# Altium schematic sheet 04_DISCRETE_MIXER_IQ.SchDoc
size A3; SheetNumber: 4; SheetTotal: 6
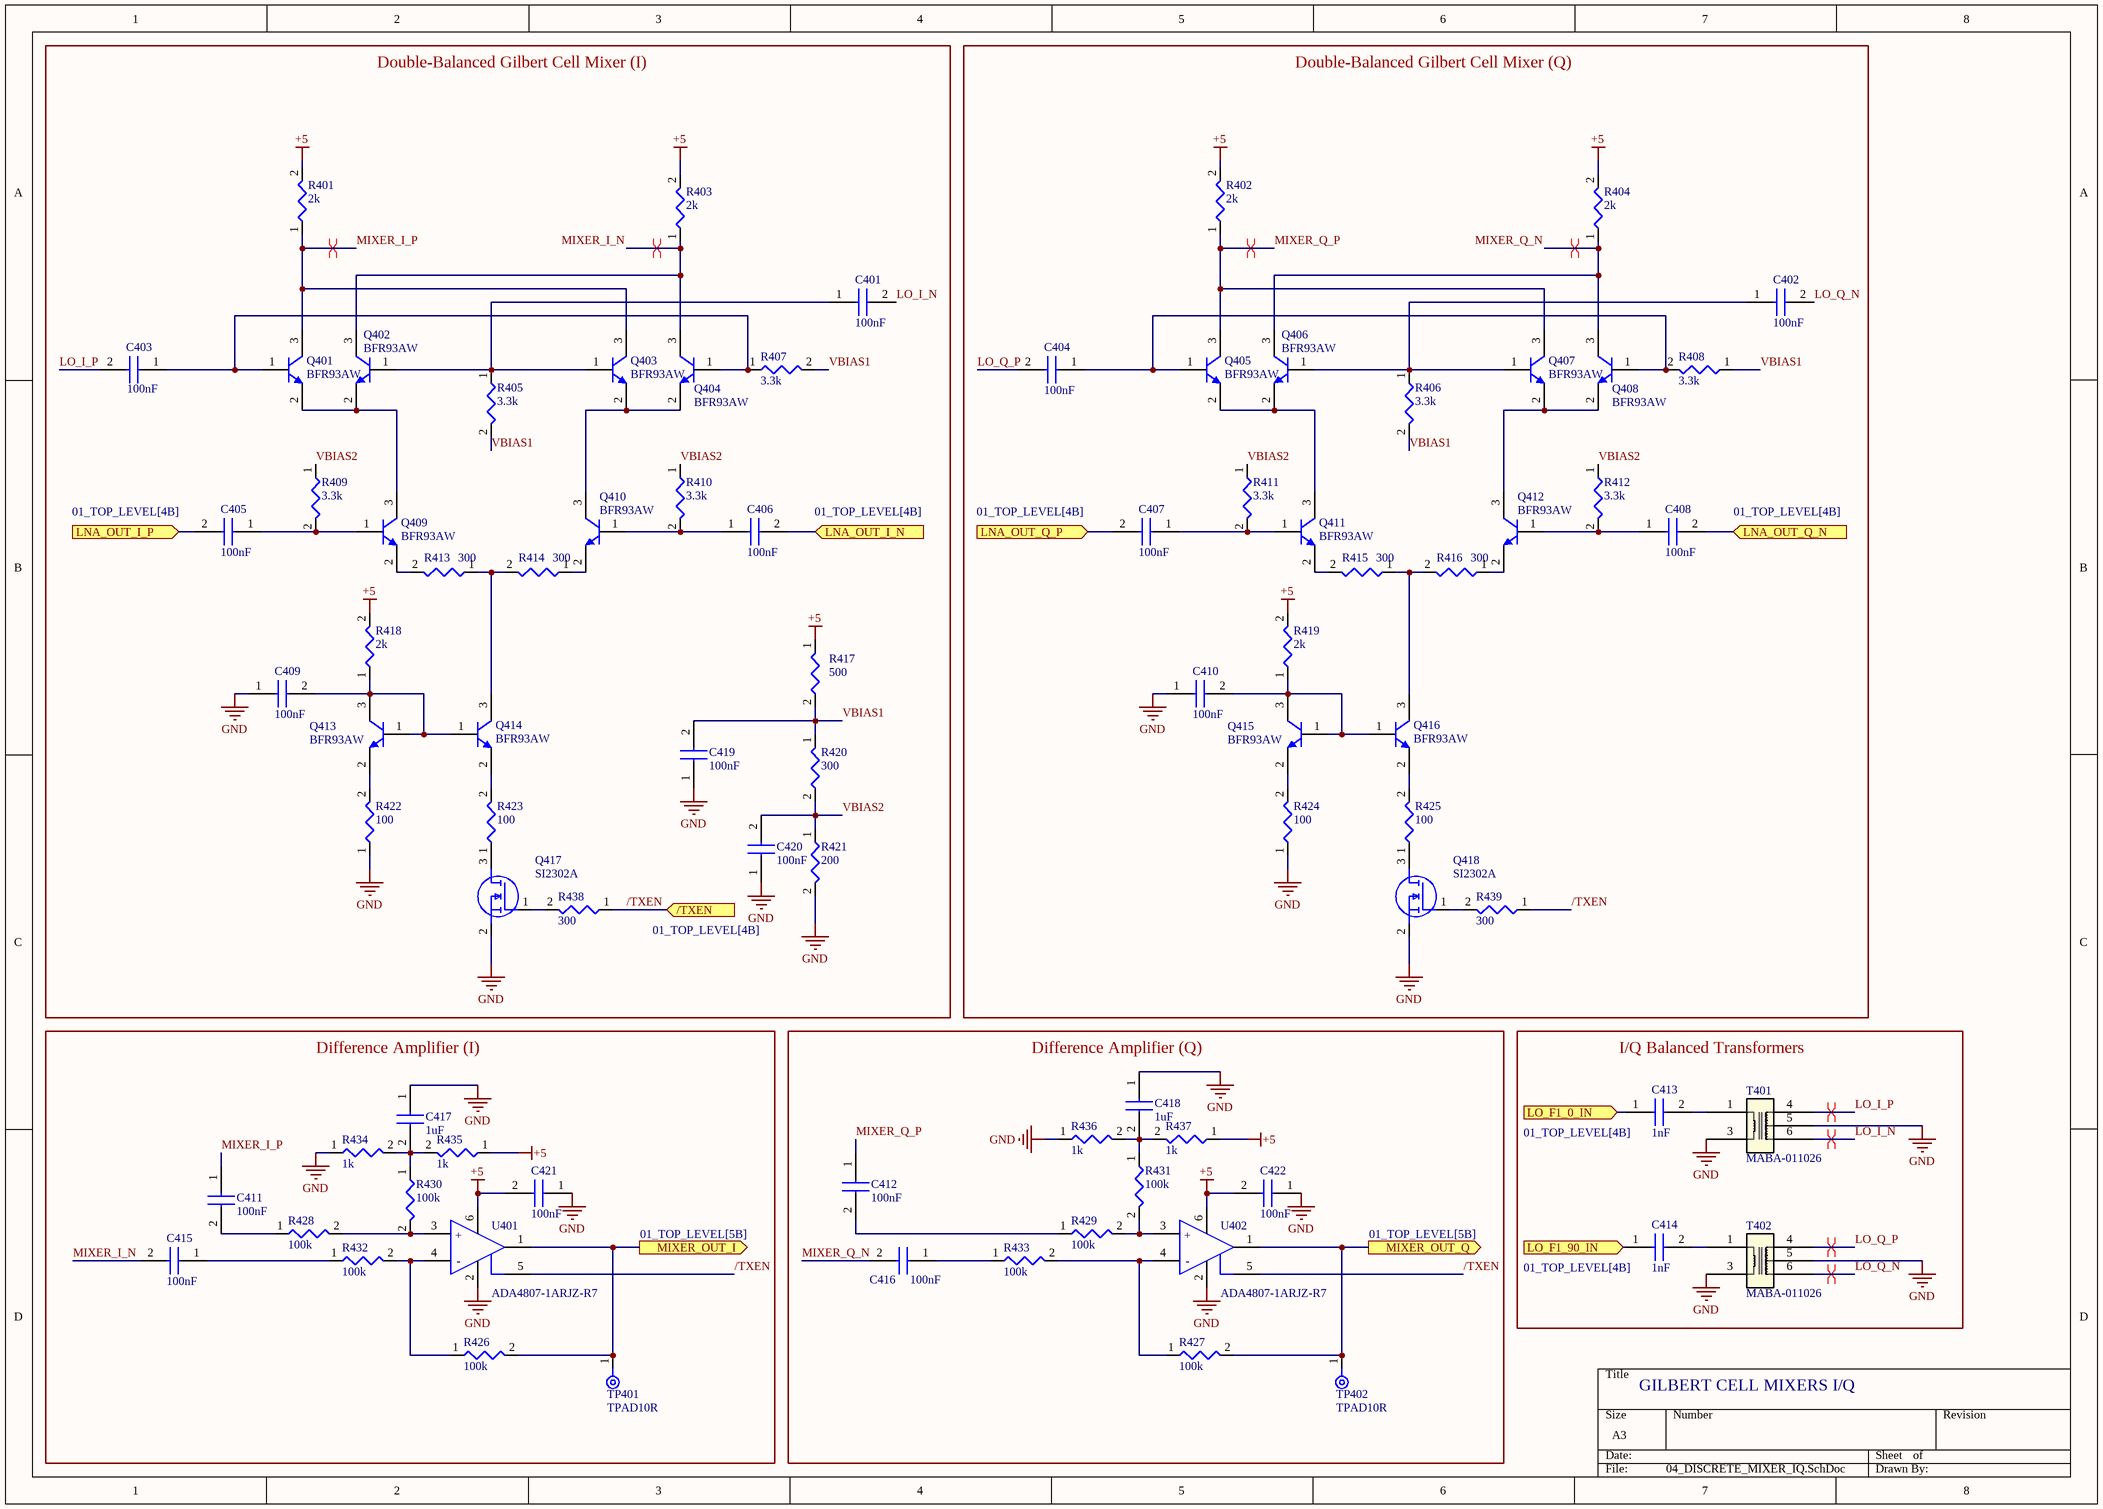
[diagram p0: 04_DISCRETE_MIXER_IQ.SchDoc]

## Parts
C401  100nF  [CAP_0805]
C402  100nF  [CAP_0805]
C403  100nF  [CAP_0805]
C404  100nF  [CAP_0805]
C405  100nF  [CAP_0805]
C406  100nF  [CAP_0805]
C407  100nF  [CAP_0805]
C408  100nF  [CAP_0805]
C409  100nF  [CAP_0805]
C410  100nF  [CAP_0805]
C411  100nF  [CAP_0805]
C412  100nF  [CAP_0805]
C413  1nF  [CAP_0805]
C414  1nF  [CAP_0805]
C415  100nF  [CAP_0805]
C416  100nF  [CAP_0805]
C417  1uF  [CAP_0805]
C418  1uF  [CAP_0805]
C419  100nF  [CAP_0805]
C420  100nF  [CAP_0805]
C421  100nF  [CAP_0805]
C422  100nF  [CAP_0805]
Q401  BFR93AW  [INF-SOT323_M]
Q402  BFR93AW  [INF-SOT323_M]
Q403  BFR93AW  [INF-SOT323_M]
Q404  BFR93AW  [INF-SOT323_M]
Q405  BFR93AW  [INF-SOT323_M]
Q406  BFR93AW  [INF-SOT323_M]
Q407  BFR93AW  [INF-SOT323_M]
Q408  BFR93AW  [INF-SOT323_M]
Q409  BFR93AW  [INF-SOT323_M]
Q410  BFR93AW  [INF-SOT323_M]
Q411  BFR93AW  [INF-SOT323_M]
Q412  BFR93AW  [INF-SOT323_M]
Q413  BFR93AW  [INF-SOT323_M]
Q414  BFR93AW  [INF-SOT323_M]
Q415  BFR93AW  [INF-SOT323_M]
Q416  BFR93AW  [INF-SOT323_M]
Q417  SI2302A  [SOT95P237X112-3N]
Q418  SI2302A  [SOT95P237X112-3N]
R401  2k  [RES_0805]
R402  2k  [RES_0805]
R403  2k  [RES_0805]
R404  2k  [RES_0805]
R405  3.3k  [RES_0805]
R406  3.3k  [RES_0805]
R407  3.3k  [RES_0805]
R408  3.3k  [RES_0805]
R409  3.3k  [RES_0805]
R410  3.3k  [RES_0805]
R411  3.3k  [RES_0805]
R412  3.3k  [RES_0805]
R413  300  [RES_0805]
R414  300  [RES_0805]
R415  300  [RES_0805]
R416  300  [RES_0805]
R417  500  [RES_0805]
R418  2k  [RES_0805]
R419  2k  [RES_0805]
R420  300  [RES_0805]
R421  200  [RES_0805]
R422  100  [RES_0805]
R423  100  [RES_0805]
R424  100  [RES_0805]
R425  100  [RES_0805]
R426  100k  [RES_0805]
R427  100k  [RES_0805]
R428  100k  [RES_0805]
R429  100k  [RES_0805]
R430  100k  [RES_0805]
R431  100k  [RES_0805]
R432  100k  [RES_0805]
R433  100k  [RES_0805]
R434  1k  [RES_0805]
R435  1k  [RES_0805]
R436  1k  [RES_0805]
R437  1k  [RES_0805]
R438  300  [RES_0805]
R439  300  [RES_0805]
T401  MABA-011026  [MABA-011026_MCM]
T402  MABA-011026  [MABA-011026_MCM]
TP401  TPAD10R  [TEST_POINT]
TP402  TPAD10R  [TEST_POINT]
U401  ADA4807-1ARJZ-R7  [FP-RJ-6-IPC_A]
U402  ADA4807-1ARJZ-R7  [FP-RJ-6-IPC_A]

## Blocks framed on the sheet
Double-Balanced Gilbert Cell Mixer (I): C401 C403 C405 C406 C409 C419 C420 Q401-Q404 Q409 Q410 Q413 Q414 Q417 R401 R403 R405 R407 R409 R410 R413 R414 R417 R418 R420-R423 R438
Double-Balanced Gilbert Cell Mixer (Q): C402 C404 C407 C408 C410 Q405-Q408 Q411 Q412 Q415 Q416 Q418 R402 R404 R406 R408 R411 R412 R415 R416 R419 R424 R425 R439
Difference Amplifier (I): C411 C415 C417 C421 R426 R428 R430 R432 R434 R435 TP401 U401
Difference Amplifier (Q): C412 C416 C418 C422 R427 R429 R431 R433 R436 R437 TP402 U402
I/Q Balanced Transformers: C413 C414 T401 T402

## Ports
/TXEN (in, see 01_TOP_LEVEL[4B]), LNA_OUT_I_N (in, see 01_TOP_LEVEL[4B]), LNA_OUT_I_P (in, see 01_TOP_LEVEL[4B]), LNA_OUT_Q_N (in, see 01_TOP_LEVEL[4B]), LNA_OUT_Q_P (in, see 01_TOP_LEVEL[4B]), LO_F1_0_IN (in, see 01_TOP_LEVEL[4B]), LO_F1_90_IN (in, see 01_TOP_LEVEL[4B]), MIXER_OUT_I (out, see 01_TOP_LEVEL[5B]), MIXER_OUT_Q (out, see 01_TOP_LEVEL[5B])

## Nets
+5: C421.2 C422.2 R401.2 R402.2 R403.2 R404.2 R417.1 R418.2 R419.2 R435.1 R437.1 U401.6(+VS) U402.6(+VS)
GND: C409.1 C410.1 C417.1 C418.1 C419.1 C420.1 C421.1 C422.1 Q417.2(S) Q418.2(S) R421.2 R422.1 R424.1 R434.1 R436.1 T401.3 T401.5 T402.3 T402.5 U401.2(-VS) U402.2(-VS)
/TXEN: R438.1 R439.1 U401.5(~{DISABLE}) U402.5(~{DISABLE}) ; port /TXEN
LNA_OUT_I_N: C406.2 ; port LNA_OUT_I_N
LNA_OUT_I_P: C405.2 ; port LNA_OUT_I_P
LNA_OUT_Q_N: C408.2 ; port LNA_OUT_Q_N
LNA_OUT_Q_P: C407.2 ; port LNA_OUT_Q_P
LO_F1_0_IN: C413.1 ; port LO_F1_0_IN
LO_F1_90_IN: C414.1 ; port LO_F1_90_IN
LO_I_N: C401.2 T401.6
LO_I_P: C403.2 T401.4
LO_Q_N: C402.2 T402.6
LO_Q_P: C404.2 T402.4
MIXER_I_N: C415.2 Q402.3(C) Q404.3(C) R403.1
MIXER_I_P: C411.1 Q401.3(C) Q403.3(C) R401.1
MIXER_OUT_I: R426.2 TP401.1 U401.1(VOUT) ; port MIXER_OUT_I
MIXER_OUT_Q: R427.2 TP402.1 U402.1(VOUT) ; port MIXER_OUT_Q
MIXER_Q_N: C416.2 Q406.3(C) Q408.3(C) R404.1
MIXER_Q_P: C412.1 Q405.3(C) Q407.3(C) R402.1
VBIAS1: C419.2 R405.2 R406.2 R407.2 R408.1 R417.2 R420.1
VBIAS2: C420.2 R409.1 R410.1 R411.1 R412.1 R420.2 R421.1
NetC401_1: C401.1 Q402.1(B) Q403.1(B) R405.1
NetC402_1: C402.1 Q406.1(B) Q407.1(B) R406.1
NetC403_1: C403.1 Q401.1(B) Q404.1(B) R407.1
NetC404_1: C404.1 Q405.1(B) Q408.1(B) R408.2
NetC405_1: C405.1 Q409.1(B) R409.2
NetC406_1: C406.1 Q410.1(B) R410.2
NetC407_1: C407.1 Q411.1(B) R411.2
NetC408_1: C408.1 Q412.1(B) R412.2
NetC409_2: C409.2 Q413.1(B) Q413.3(C) Q414.1(B) R418.1
NetC410_2: C410.2 Q415.1(B) Q415.3(C) Q416.1(B) R419.1
NetC411_2: C411.2 R428.1
NetC412_2: C412.2 R429.1
NetC413_2: C413.2 T401.1
NetC414_2: C414.2 T402.1
NetC415_1: C415.1 R432.1
NetC416_1: C416.1 R433.1
NetC417_2: C417.2 R430.1 R434.2 R435.2
NetC418_2: C418.2 R431.1 R436.2 R437.2
NetQ401_2: Q401.2(E) Q402.2(E) Q409.3(C)
NetQ403_2: Q403.2(E) Q404.2(E) Q410.3(C)
NetQ405_2: Q405.2(E) Q406.2(E) Q411.3(C)
NetQ407_2: Q407.2(E) Q408.2(E) Q412.3(C)
NetQ409_2: Q409.2(E) R413.2
NetQ410_2: Q410.2(E) R414.1
NetQ411_2: Q411.2(E) R415.2
NetQ412_2: Q412.2(E) R416.1
NetQ413_2: Q413.2(E) R422.2
NetQ414_2: Q414.2(E) R423.2
NetQ414_3: Q414.3(C) R413.1 R414.2
NetQ415_2: Q415.2(E) R424.2
NetQ416_2: Q416.2(E) R425.2
NetQ416_3: Q416.3(C) R415.1 R416.2
NetQ417_1: Q417.1(G) R438.2
NetQ417_3: Q417.3(D) R423.1
NetQ418_1: Q418.1(G) R439.2
NetQ418_3: Q418.3(D) R425.1
NetR426_1: R426.1 R432.2 U401.4(-IN)
NetR427_1: R427.1 R433.2 U402.4(-IN)
NetR428_2: R428.2 R430.2 U401.3(+IN)
NetR429_2: R429.2 R431.2 U402.3(+IN)

## Layout directives
differential pair: LO_I_N, LO_I_P, LO_Q_N, LO_Q_P, MIXER_I_N, MIXER_I_P, MIXER_Q_N, MIXER_Q_P

## Notes on the sheet
- GILBERT CELL MIXERS I/Q
- (in symbol CMP-09116-000179-1) +; -

## Library data of the parts
C401-C422 = CAP_0805: Capacitor SMD 0805; Height: 0.94mm
Q401-Q416 = CMP-1189-00009-1: NPN Silicon RF Transistor, 12 V VCEO, 90 mA IC, 15.5 dB Gmax, SOT323, Green; Manufacturer: Infineon; IC (max): 90 mA; NFmin (typ): 1.5 dB; Gmax (typ): 15.5 dB; Group: For low frequencies, e.g. VHF/UHF; VCEO (max): 12 V; Ptot (max): 300mW; Green: yes; ComponentLink3Description: Package Specification; PartNumber: BFR93AW; ComponentLink2URL: http://www.infineon.com/dgdl/Infineon_LNA_BFR93AW.pdf?folderId=db3a30431400ef68011425b1354605c1&fileId=db3a30431441fb5d0114acaaec8c148f&location=en.Products.RF.RF_Transistors_.High_Linearity_Si-_and_SiGe_C-Transistors_for_use_up_to_6_GHz.DATASHEET.Infineon; ComponentLink3URL: http://www.infineon.com/dgdl/SOT323-Package_Overview.pdf?folderId=db3a30431936bc4b0119533e1dcb3c92&fileId=db3a30431936bc4b011953495f283cb1; ComponentLink2Description: Datasheet; Halogen-free: yes; ComponentLink1URL: http://www.infineon.com/; PackageReference: SOT323; PackageDescription: 3-Pin Small Outline Transistor Package, 1.25 x 2 mm Body, 0.65 mm Pitch; ComponentLink1Description: Manufacturer URL; Mounting Technology: Surface Mount; DatasheetVersion: Jul-2012; ComponentLink4Description: DigiKey; ComponentLink4URL: https://www.digikey.com/en/products/detail/infineon-technologies/BFR93AWH6327XTSA1/2337797
Q417 Q418 = SI2302ADS: MOSFET (N-Channel); Manufacturer_Name: UMW; Datasheet Link: https://mm.digikey.com/Volume0/opasdata/d220001/medias/docus/2593/UMW%20SI2302A.pdf; Height: 1.12mm; Manufacturer_Part_Number: SI2302A; ComponentLink2Description: DigiKey; ComponentLink2URL: https://www.digikey.com/en/products/detail/umw/SI2302A/16705922
R401-R439 = RES_0805: Resistor SMD 0805
T401 T402 = MABA-011026: RF Transformer; Manufacturer_Name: MACOM; Frequency Range: 2MHz ~ 200MHz; Impedance: 1:1; Insertion Loss: 1.0dB; Return Loss: 12.0dB; Phase Difference: 0.5°; Copyright: Copyright (C) 2025 Ultra Librarian. All rights reserved.; Manufacturer_Part_Number: MABA-011026; Data Sheet: https://cdn.macom.com/datasheets/MABA-011026.pdf; Package: SMD; ComponentLink1Description: DigiKey; ComponentLink1URL: https://www.digikey.com/en/products/detail/macom-technology-solutions/MABA-011026/12757346
TP401 TP402 = TEST_POINT: Testpont Pad 10R
U401 U402 = CMP-09116-000179-1: IC OPAMP VFB 1 CIRCUIT SOT23-6; -3db Bandwidth: 180MHz; Max Frequency: 100kHz; Bandwidth: 200MHz; Min Supply Voltage: 3V; Max Input Voltage: 11V; Common Mode Rejection Ratio: 96dB; Power Supply Rejection Ratio (PSRR): 105dB; Output Current: 60mA; Input Offset Voltage (Vos): 20uV; Output Current per Channel: 106mA; Number of Circuits: 1; Min Input Voltage: 2.7V; Operating Supply Voltage: 10V; Input Bias Current: 1.2uA; Operating Supply Current: 950uA; Voltage Gain: 130dB; Slew Rate: 225V/µs; Dual Supply Voltage: 5V; Height: 1.3mm; Min Operating Temperature: -40°C; Mount: Surface Mount; Lead Free: Contains Lead; Gain Bandwidth Product: 200MHz; Contact Plating: Tin; Width: 1.7mm; Packaging: Cut Tape; Max Operating Temperature: 125°C; Case/Package: SOT-23-6; Number of Pins: 6; Length: 3mm; REACH SVHC: No SVHC; Max Supply Voltage: 11V; RoHS Compliant: Yes; Number of Amplifiers: 1; ComponentLink1Description: DigiKey; ComponentLink1URL: https://www.digikey.com/en/products/detail/analog-devices-inc/ADA4807-1ARJZ-R2/5057389